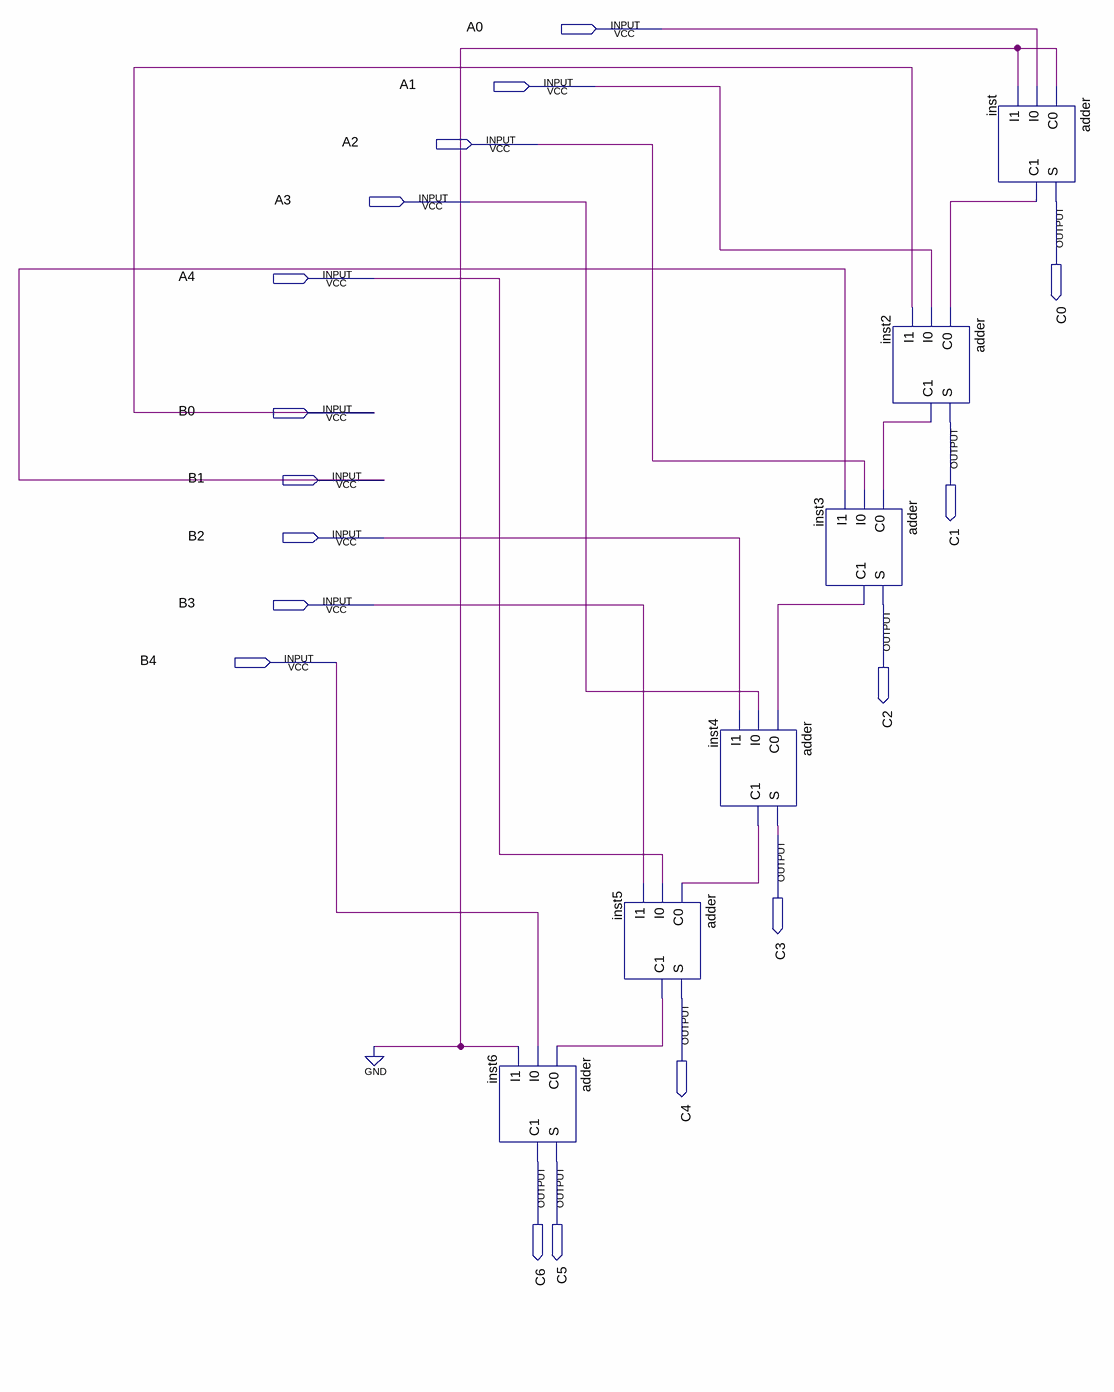
[diagram p0: schematic sheet]
// Quartus schematic cadd.bdf as structural Verilog: 6 symbols, 17 pins
module cadd (
  input  A0,
  input  A1,
  input  A2,
  input  A3,
  input  A4,
  input  B0,
  input  B1,
  input  B2,
  input  B3,
  input  B4,
  output C0,
  output C1,
  output C2,
  output C3,
  output C4,
  output C6,
  output C5
);

  wire inst2_c1, inst3_c1, inst4_c1, inst5_c1, inst_c1;

  adder inst6 (.C0(inst5_c1), .I0(B4), .I1(1'b0), .S(C5), .C1(C6));
  adder inst5 (.C0(inst4_c1), .I0(A4), .I1(B3), .S(C4), .C1(inst5_c1));
  adder inst4 (.C0(inst3_c1), .I0(A3), .I1(B2), .S(C3), .C1(inst4_c1));
  adder inst3 (.C0(inst2_c1), .I0(A2), .I1(B1), .S(C2), .C1(inst3_c1));
  adder inst2 (.C0(inst_c1), .I0(A1), .I1(B0), .S(C1), .C1(inst2_c1));
  adder inst (.C0(1'b0), .I0(A0), .I1(1'b0), .S(C0), .C1(inst_c1));
endmodule
